# EAGLE schematic sodimm_perf (EAGLE 7.4.0)
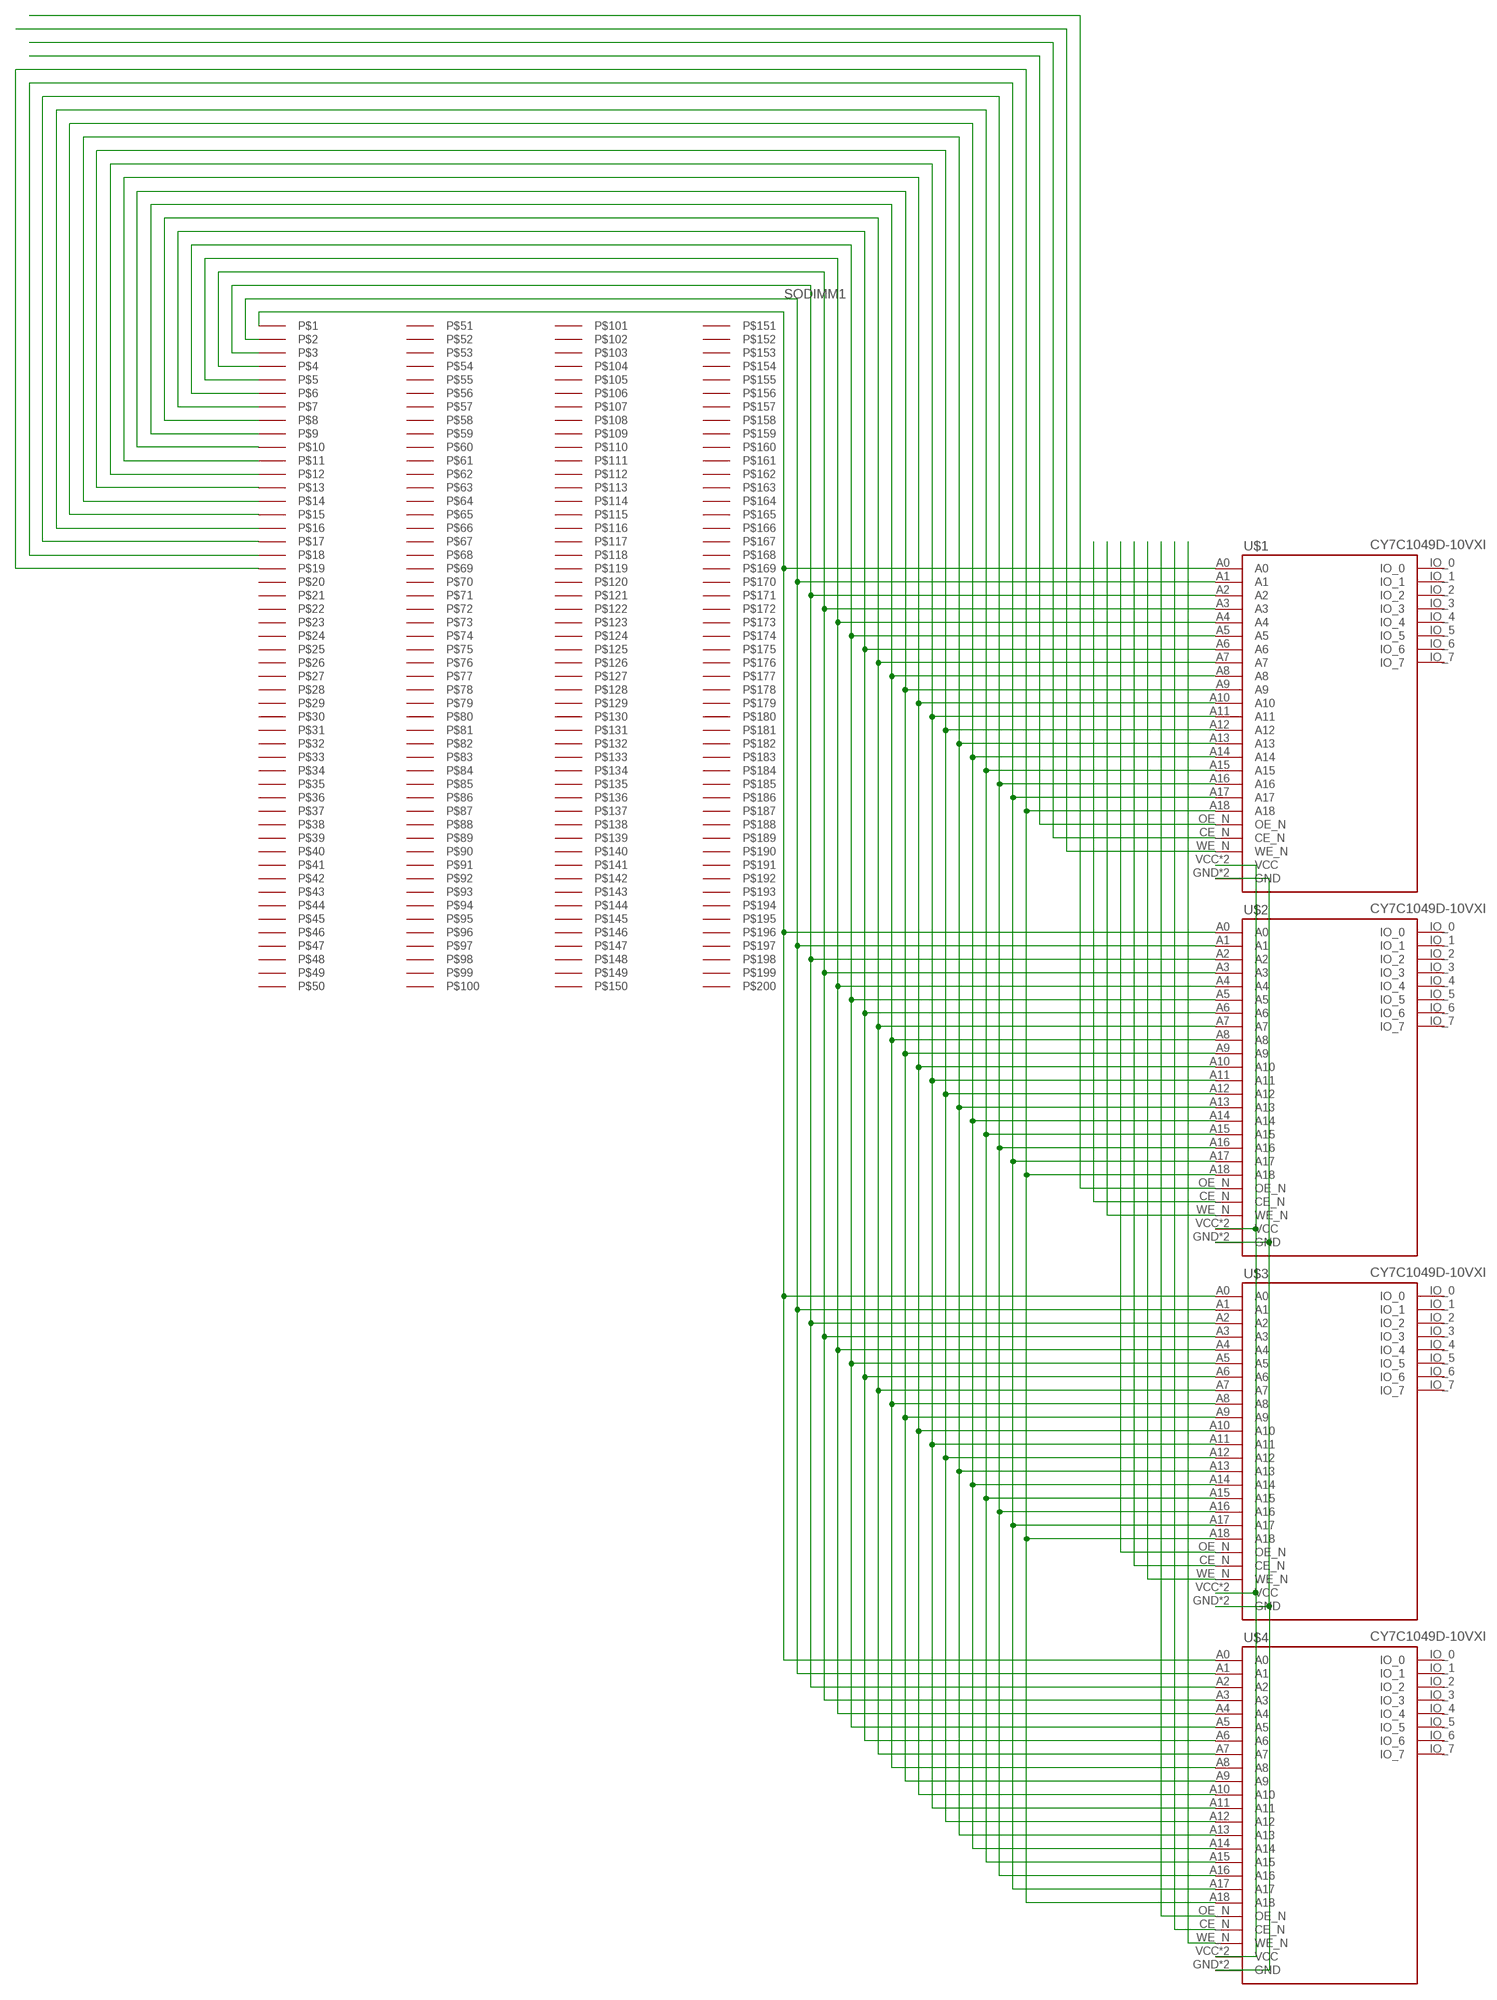
[diagram p0: schematic, sheet 1]

## Parts
SODIMM1  SODIMM_BOARD  [SODIMM_BOARD-67.6X42.5]
U$1  CY7C1049D-10VXI  [SOJ36]
U$2  CY7C1049D-10VXI  [SOJ36]
U$3  CY7C1049D-10VXI  [SOJ36]
U$4  CY7C1049D-10VXI  [SOJ36]

## Nets
N$1: SODIMM1.1 U$1.A0 U$2.A0 U$3.A0 U$4.A0
N$2: SODIMM1.2 U$1.A1 U$2.A1 U$3.A1 U$4.A1
N$3: SODIMM1.3 U$1.A2 U$2.A2 U$3.A2 U$4.A2
N$4: SODIMM1.4 U$1.A3 U$2.A3 U$3.A3 U$4.A3
N$5: SODIMM1.5 U$1.A4 U$2.A4 U$3.A4 U$4.A4
N$6: SODIMM1.6 U$1.A5 U$2.A5 U$3.A5 U$4.A5
N$7: SODIMM1.7 U$1.A6 U$2.A6 U$3.A6 U$4.A6
N$8: SODIMM1.10 U$1.A9 U$2.A9 U$3.A9 U$4.A9
N$9: SODIMM1.11 U$1.A10 U$2.A10 U$3.A10 U$4.A10
N$10: SODIMM1.12 U$1.A11 U$2.A11 U$3.A11 U$4.A11
N$11: SODIMM1.13 U$1.A12 U$2.A12 U$3.A12 U$4.A12
N$12: SODIMM1.14 U$1.A13 U$2.A13 U$3.A13 U$4.A13
N$13: SODIMM1.15 U$1.A14 U$2.A14 U$3.A14 U$4.A14
N$14: SODIMM1.16 U$1.A15 U$2.A15 U$3.A15 U$4.A15
N$15: SODIMM1.8 U$1.A7 U$2.A7 U$3.A7 U$4.A7
N$16: SODIMM1.9 U$1.A8 U$2.A8 U$3.A8 U$4.A8
N$17: SODIMM1.17 U$1.A16 U$2.A16 U$3.A16 U$4.A16
N$18: SODIMM1.18 U$1.A17 U$2.A17 U$3.A17 U$4.A17
N$19: SODIMM1.19 U$1.A18 U$2.A18 U$3.A18 U$4.A18
N$20: U$1.VCC U$1.VCC_(VCC) U$2.VCC U$2.VCC_(VCC) U$3.VCC U$3.VCC_(VCC) U$4.VCC U$4.VCC_(VCC)
N$21: U$1.GND U$1.GND_(GND) U$2.GND U$2.GND_(GND) U$3.GND U$3.GND_(GND) U$4.GND U$4.GND_(GND)
N$22: U$1.OE_N
N$23: U$1.CE_N
N$24: U$1.WE_N
N$25: U$2.OE_N
N$26: U$2.CE_N
N$27: U$2.WE_N
N$28: U$3.OE_N
N$29: U$3.CE_N
N$30: U$3.WE_N
N$31: U$4.OE_N
N$32: U$4.CE_N
N$33: U$4.WE_N
Unconnected: SODIMM1.20 SODIMM1.21 SODIMM1.22 SODIMM1.23 SODIMM1.24 SODIMM1.25 SODIMM1.26 SODIMM1.27 SODIMM1.28 SODIMM1.29 SODIMM1.30 SODIMM1.31 SODIMM1.32 SODIMM1.33 SODIMM1.34 SODIMM1.35 SODIMM1.36 SODIMM1.37 SODIMM1.38 SODIMM1.39 SODIMM1.40 SODIMM1.41 SODIMM1.42 SODIMM1.43 SODIMM1.44 SODIMM1.45 SODIMM1.46 SODIMM1.47 SODIMM1.48 SODIMM1.49 SODIMM1.50 SODIMM1.51 SODIMM1.52 SODIMM1.53 SODIMM1.54 SODIMM1.55 SODIMM1.56 SODIMM1.57 SODIMM1.58 SODIMM1.59 SODIMM1.60 SODIMM1.61 SODIMM1.62 SODIMM1.63 SODIMM1.64 SODIMM1.65 SODIMM1.66 SODIMM1.67 SODIMM1.68 SODIMM1.69 SODIMM1.70 SODIMM1.71 SODIMM1.72 SODIMM1.73 SODIMM1.74 SODIMM1.75 SODIMM1.76 SODIMM1.77 SODIMM1.78 SODIMM1.79 SODIMM1.80 SODIMM1.81 SODIMM1.82 SODIMM1.83 SODIMM1.84 SODIMM1.85 SODIMM1.86 SODIMM1.87 SODIMM1.88 SODIMM1.89 SODIMM1.90 SODIMM1.91 SODIMM1.92 SODIMM1.93 SODIMM1.94 SODIMM1.95 SODIMM1.96 SODIMM1.97 SODIMM1.98 SODIMM1.99 SODIMM1.100 SODIMM1.101 SODIMM1.102 SODIMM1.103 SODIMM1.104 SODIMM1.105 SODIMM1.106 SODIMM1.107 SODIMM1.108 SODIMM1.109 SODIMM1.110 SODIMM1.111 SODIMM1.112 SODIMM1.113 SODIMM1.114 SODIMM1.115 SODIMM1.116 SODIMM1.117 SODIMM1.118 SODIMM1.119 SODIMM1.120 SODIMM1.121 SODIMM1.122 SODIMM1.123 SODIMM1.124 SODIMM1.125 SODIMM1.126 SODIMM1.127 SODIMM1.128 SODIMM1.129 SODIMM1.130 SODIMM1.131 SODIMM1.132 SODIMM1.133 SODIMM1.134 SODIMM1.135 SODIMM1.136 SODIMM1.137 SODIMM1.138 SODIMM1.139 SODIMM1.140 SODIMM1.141 SODIMM1.142 SODIMM1.143 SODIMM1.144 SODIMM1.145 SODIMM1.146 SODIMM1.147 SODIMM1.148 SODIMM1.149 SODIMM1.150 SODIMM1.151 SODIMM1.152 SODIMM1.153 SODIMM1.154 SODIMM1.155 SODIMM1.156 SODIMM1.157 SODIMM1.158 SODIMM1.159 SODIMM1.160 SODIMM1.161 SODIMM1.162 SODIMM1.163 SODIMM1.164 SODIMM1.165 SODIMM1.166 SODIMM1.167 SODIMM1.168 SODIMM1.169 SODIMM1.170 SODIMM1.171 SODIMM1.172 SODIMM1.173 SODIMM1.174 SODIMM1.175 SODIMM1.176 SODIMM1.177 SODIMM1.178 SODIMM1.179 SODIMM1.180 SODIMM1.181 SODIMM1.182 SODIMM1.183 SODIMM1.184 SODIMM1.185 SODIMM1.186 SODIMM1.187 SODIMM1.188 SODIMM1.189 SODIMM1.190 SODIMM1.191 SODIMM1.192 SODIMM1.193 SODIMM1.194 SODIMM1.195 SODIMM1.196 SODIMM1.197 SODIMM1.198 SODIMM1.199 SODIMM1.200 U$1.IO_0 U$1.IO_1 U$1.IO_2 U$1.IO_3 U$1.IO_4 U$1.IO_5 U$1.IO_6 U$1.IO_7 U$2.IO_0 U$2.IO_1 U$2.IO_2 U$2.IO_3 U$2.IO_4 U$2.IO_5 U$2.IO_6 U$2.IO_7 U$3.IO_0 U$3.IO_1 U$3.IO_2 U$3.IO_3 U$3.IO_4 U$3.IO_5 U$3.IO_6 U$3.IO_7 U$4.IO_0 U$4.IO_1 U$4.IO_2 U$4.IO_3 U$4.IO_4 U$4.IO_5 U$4.IO_6 U$4.IO_7

## Library data of the parts
SODIMM1 = BaseApp:SODIMM_BOARD: SODIMM BOARD Thickness of board must be 1mm.
U$1-U$4 = CY8C5888LTI-LP097:CY7C1049D-10VXI